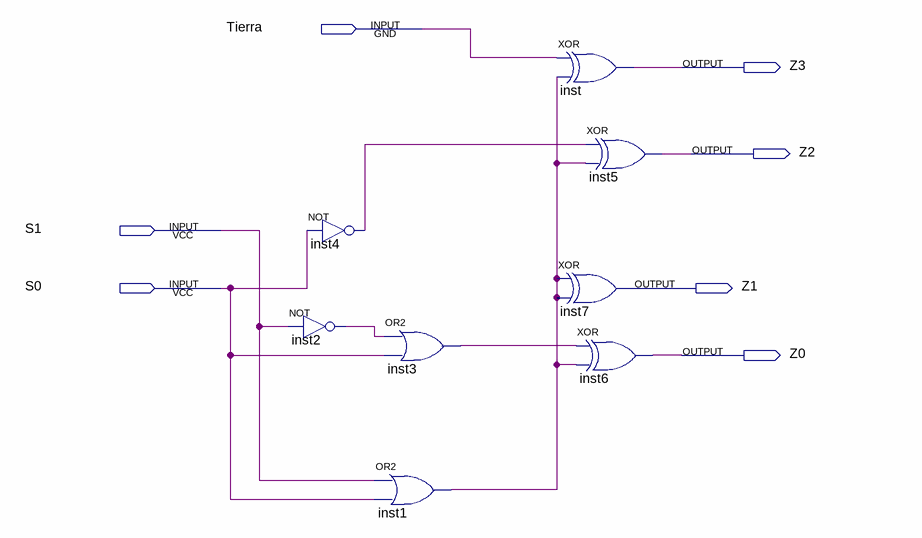
[diagram p0: schematic sheet]
// Quartus schematic BloqueZ.bdf as structural Verilog: 8 symbols, 7 pins
module BloqueZ (
  input  Tierra,
  input  S1,
  input  S0,
  output Z3,
  output Z2,
  output Z1,
  output Z0
);

  wire inst1_out, inst2_out, inst3_out, inst4_out;

  not inst2 (inst2_out, S1);
  not inst4 (inst4_out, S0);
  or inst3 (inst3_out, inst2_out, S0);
  or inst1 (inst1_out, S1, S0);
  xor inst (Z3, Tierra, inst1_out);
  xor inst5 (Z2, inst4_out, inst1_out);
  xor inst7 (Z1, inst1_out, inst1_out);
  xor inst6 (Z0, inst3_out, inst1_out);
endmodule
